# Altium schematic sheet LCD_ADS131A04.SchDoc
size A4; SheetNumber: 8; SheetTotal: 8
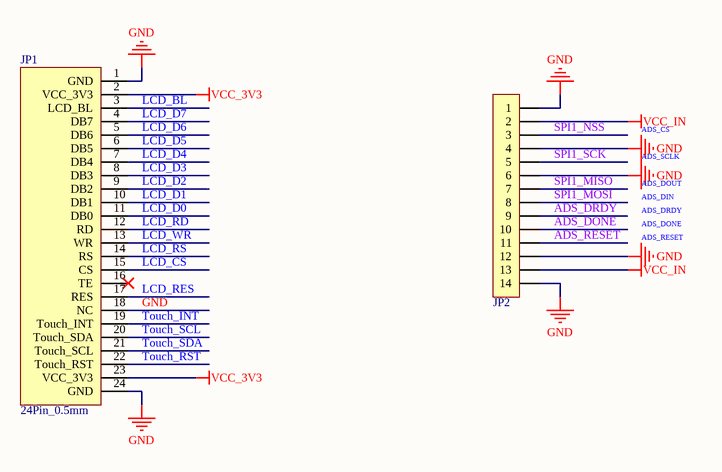
[diagram p0: LCD_ADS131A04.SchDoc]

## Parts
JP1  24Pin_0.5mm  [FPC0.5-WT-24P]
JP2  HDR-1X14  [FPC0.5-WT-14P]  (value not drawn)

## Nets
GND: JP1.1(GND) JP1.18(NC) JP1.24(GND) JP2.1 JP2.4 JP2.6 JP2.12 JP2.14
VCC_3V3: JP1.2(VCC_3V3) JP1.23(VCC_3V3)
VCC_IN: JP2.2 JP2.13
ADS_DONE: JP2.10
ADS_DRDY: JP2.9
ADS_RESET: JP2.11
LCD_BL: JP1.3(LCD_BL)
LCD_CS: JP1.15(CS)
LCD_D0: JP1.11(DB0)
LCD_D1: JP1.10(DB1)
LCD_D2: JP1.9(DB2)
LCD_D3: JP1.8(DB3)
LCD_D4: JP1.7(DB4)
LCD_D5: JP1.6(DB5)
LCD_D6: JP1.5(DB6)
LCD_D7: JP1.4(DB7)
LCD_RD: JP1.12(RD)
LCD_RES: JP1.17(RES)
LCD_RS: JP1.14(RS)
LCD_WR: JP1.13(WR)
SPI1_MISO: JP2.7
SPI1_MOSI: JP2.8
SPI1_NSS: JP2.3
SPI1_SCK: JP2.5
Touch_INT: JP1.19(Touch_INT)
Touch_RST: JP1.22(Touch_RST)
Touch_SCL: JP1.20(Touch_SDA)
Touch_SDA: JP1.21(Touch_SCL)

Not connected (* = marked no-connect by the designer): JP1 16(TE)*

## Notes on the sheet
- ADS_CS
- ADS_SCLK
- ADS_DOUT
- ADS_DIN
- ADS_DRDY
- ADS_DONE
- ADS_RESET

## Library data of the parts
JP1 = 屏幕板FPC: 屏幕板外接座
JP2 = Header 14: 14P接插件; 封装库来自淘宝卖家 ID：黄晶宝石: 其他店铺购入均为盗版假冒封装库; 联系卖家，免费查找封装: 唯一出售店铺网址https://shop463601444.taobao.com; BOM名称: 14P接插件